# Altium schematic sheet SAMC21_Xplained_Pro_Connectors.SchDoc: Extension connectors
size A3; Organization: ATMEL Norway; Address1: Vestre Rosten 79; Address2: N-7075 TILLER; Address3: NORWAY; DocumentNumber: A09-2419; Revision: 5; SheetNumber: 3; SheetTotal: 9; PageSetup: Record=PageOptions|CenterHorizontal=True|CenterVertical=True|PrintScale=1.01|XCorrection=1.00|YCorrection=1.00|PrintKind=1|BorderSize=5000000|LeftOffset=0|BottomOffset=0|Orientation=2|PaperLength=1000|PaperWidth=1000|Scale=100|PaperSource=7|PrintQuality=-4|MediaType=1|DitherType=10|PaperKind=A3 (297 x 420 mm)|PrintScaleMode=1
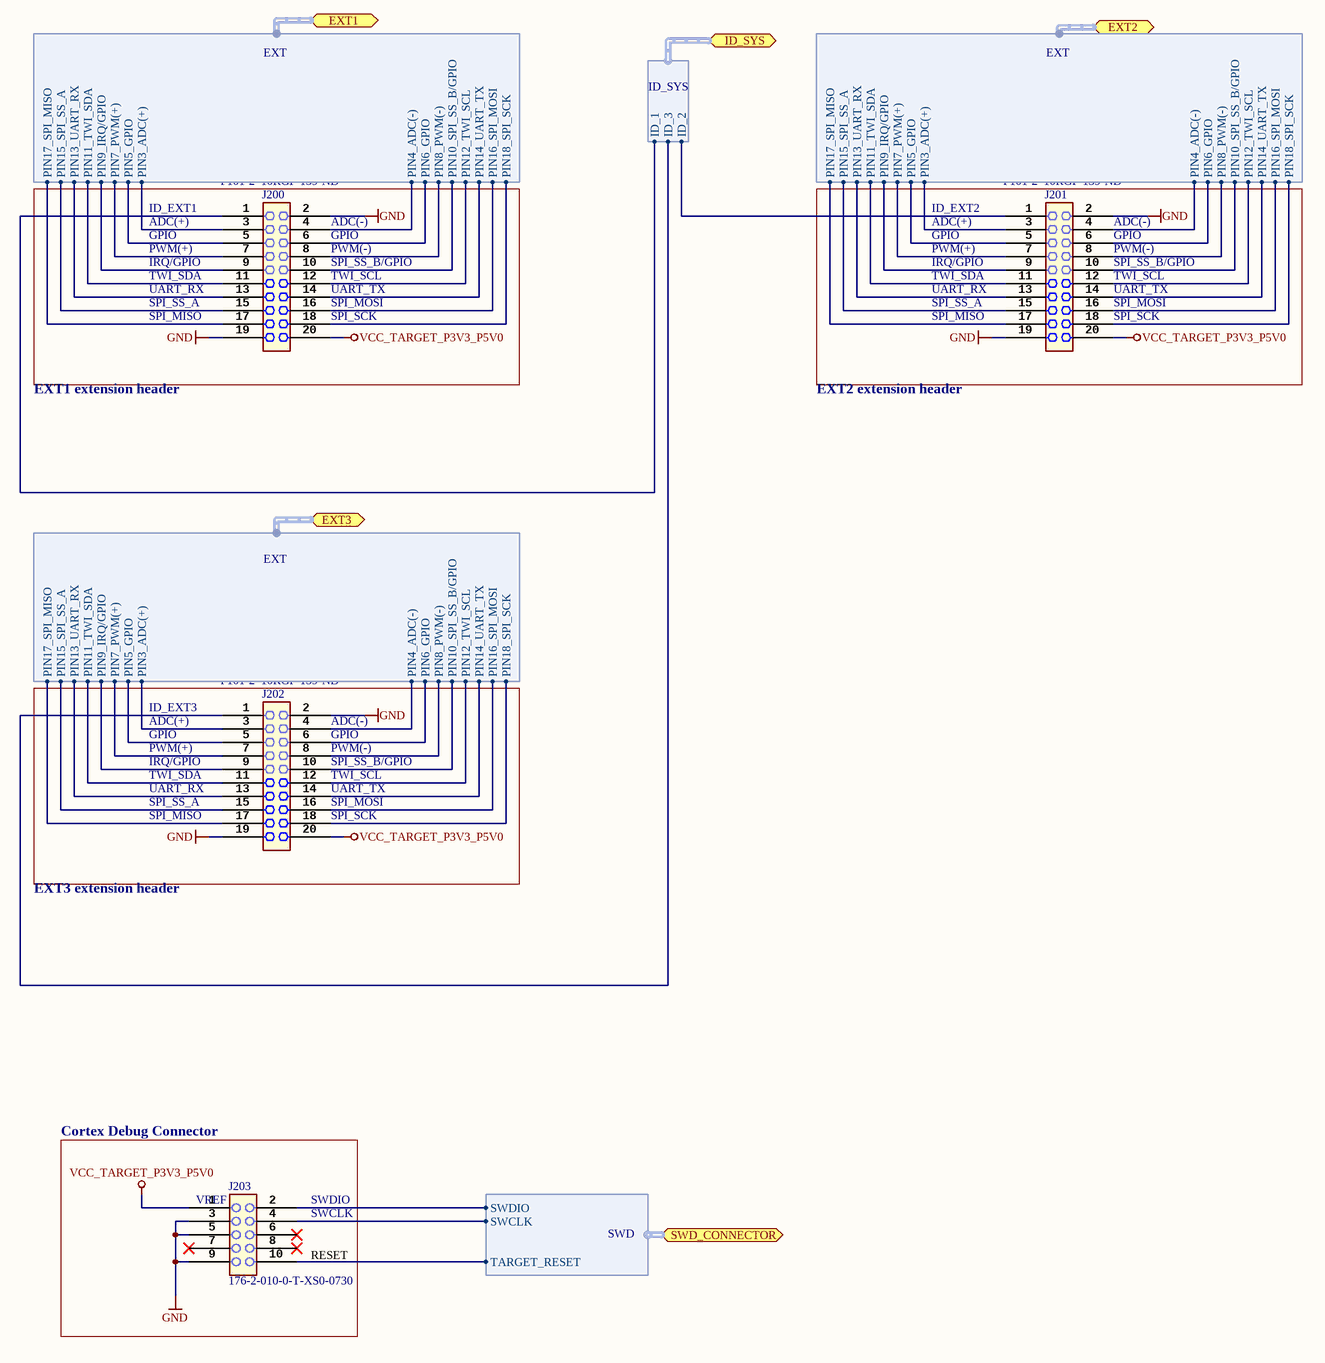
[diagram p0: SAMC21_Xplained_Pro_Connectors.SchDoc]

## Parts
J200  value P101-2*10RGF-139-ND  [AP8-00622]
J201  value P101-2*10RGF-139-ND  [AP8-00622]
J202  value P101-2*10RGF-139-ND  [AP8-00622]
J203  MPN: 176-2-010-0-T-XS0-0730  [AP8-00257]

## Blocks framed on the sheet
Cortex Debug Connector: J203

## Ports
EXT1 (harness EXT), EXT2 (harness EXT), EXT3 (harness EXT), ID_SYS (harness ID_SYS), SWD_CONNECTOR (harness SWD)

## Harnesses
ID_SYS: ID_1, ID_2, ID_3
EXT: PIN3_ADC(+), PIN4_ADC(-), PIN5_GPIO, PIN6_GPIO, PIN7_PWM(+), PIN8_PWM(-), PIN9_IRQ/GPIO, PIN10_SPI_SS_B/GPIO, PIN11_TWI_SDA, PIN12_TWI_SCL, PIN13_UART_RX, PIN14_UART_TX, PIN15_SPI_SS_A, PIN16_SPI_MOSI, PIN17_SPI_MISO, PIN18_SPI_SCK
SWD: SWCLK, SWDIO, TARGET_RESET

## Nets
GND: J200.2 J200.19 J201.2 J201.19 J202.2 J202.19 J203.3 J203.5 J203.9
VCC_TARGET_P3V3_P5V0: J200.20 J201.20 J202.20 J203.1
NetJ200_1: J200.1 ; port ID_SYS.ID_1
NetJ200_3: J200.3 ; port EXT1.PIN3_ADC(+)
NetJ200_4: J200.4 ; port EXT1.PIN4_ADC(-)
NetJ200_5: J200.5 ; port EXT1.PIN5_GPIO
NetJ200_6: J200.6 ; port EXT1.PIN6_GPIO
NetJ200_7: J200.7 ; port EXT1.PIN7_PWM(+)
NetJ200_8: J200.8 ; port EXT1.PIN8_PWM(-)
NetJ200_9: J200.9 ; port EXT1.PIN9_IRQ/GPIO
NetJ200_10: J200.10 ; port EXT1.PIN10_SPI_SS_B/GPIO
NetJ200_11: J200.11 ; port EXT1.PIN11_TWI_SDA
NetJ200_12: J200.12 ; port EXT1.PIN12_TWI_SCL
NetJ200_13: J200.13 ; port EXT1.PIN13_UART_RX
NetJ200_14: J200.14 ; port EXT1.PIN14_UART_TX
NetJ200_15: J200.15 ; port EXT1.PIN15_SPI_SS_A
NetJ200_16: J200.16 ; port EXT1.PIN16_SPI_MOSI
NetJ200_17: J200.17 ; port EXT1.PIN17_SPI_MISO
NetJ200_18: J200.18 ; port EXT1.PIN18_SPI_SCK
NetJ201_1: J201.1 ; port ID_SYS.ID_2
NetJ201_3: J201.3 ; port EXT2.PIN3_ADC(+)
NetJ201_4: J201.4 ; port EXT2.PIN4_ADC(-)
NetJ201_5: J201.5 ; port EXT2.PIN5_GPIO
NetJ201_6: J201.6 ; port EXT2.PIN6_GPIO
NetJ201_7: J201.7 ; port EXT2.PIN7_PWM(+)
NetJ201_8: J201.8 ; port EXT2.PIN8_PWM(-)
NetJ201_9: J201.9 ; port EXT2.PIN9_IRQ/GPIO
NetJ201_10: J201.10 ; port EXT2.PIN10_SPI_SS_B/GPIO
NetJ201_11: J201.11 ; port EXT2.PIN11_TWI_SDA
NetJ201_12: J201.12 ; port EXT2.PIN12_TWI_SCL
NetJ201_13: J201.13 ; port EXT2.PIN13_UART_RX
NetJ201_14: J201.14 ; port EXT2.PIN14_UART_TX
NetJ201_15: J201.15 ; port EXT2.PIN15_SPI_SS_A
NetJ201_16: J201.16 ; port EXT2.PIN16_SPI_MOSI
NetJ201_17: J201.17 ; port EXT2.PIN17_SPI_MISO
NetJ201_18: J201.18 ; port EXT2.PIN18_SPI_SCK
NetJ202_1: J202.1 ; port ID_SYS.ID_3
NetJ202_3: J202.3 ; port EXT3.PIN3_ADC(+)
NetJ202_4: J202.4 ; port EXT3.PIN4_ADC(-)
NetJ202_5: J202.5 ; port EXT3.PIN5_GPIO
NetJ202_6: J202.6 ; port EXT3.PIN6_GPIO
NetJ202_7: J202.7 ; port EXT3.PIN7_PWM(+)
NetJ202_8: J202.8 ; port EXT3.PIN8_PWM(-)
NetJ202_9: J202.9 ; port EXT3.PIN9_IRQ/GPIO
NetJ202_10: J202.10 ; port EXT3.PIN10_SPI_SS_B/GPIO
NetJ202_11: J202.11 ; port EXT3.PIN11_TWI_SDA
NetJ202_12: J202.12 ; port EXT3.PIN12_TWI_SCL
NetJ202_13: J202.13 ; port EXT3.PIN13_UART_RX
NetJ202_14: J202.14 ; port EXT3.PIN14_UART_TX
NetJ202_15: J202.15 ; port EXT3.PIN15_SPI_SS_A
NetJ202_16: J202.16 ; port EXT3.PIN16_SPI_MOSI
NetJ202_17: J202.17 ; port EXT3.PIN17_SPI_MISO
NetJ202_18: J202.18 ; port EXT3.PIN18_SPI_SCK
NetJ203_2: J203.2 ; port SWD_CONNECTOR.SWDIO
NetJ203_4: J203.4 ; port SWD_CONNECTOR.SWCLK
NetJ203_10: J203.10 ; port SWD_CONNECTOR.TARGET_RESET

Not connected (* = marked no-connect by the designer): J203 6* 7* 8*

## Notes on the sheet
- ID_EXT1
- ID_EXT2
- ADC(+)
- GPIO
- PWM(+)
- IRQ/GPIO
- TWI_SDA
- UART_RX
- (near J200) ADC(-)
- (near J200) GPIO
- (near J200) PWM(-)
- (near J200) SPI_SS_B/GPIO
- (near J200) TWI_SCL
- (near J200) UART_TX
- (near J201) ADC(-)
- (near J201) GPIO
- (near J201) PWM(-)
- (near J201) SPI_SS_B/GPIO
- (near J201) TWI_SCL
- (near J201) UART_TX
- SPI_SS_A
- SPI_MISO
- (near J200) SPI_MOSI
- (near J200) SPI_SCK
- (near J201) SPI_MOSI
- (near J201) SPI_SCK
- EXT1 extension header
- EXT2 extension header
- ID_EXT3
- (near J202) ADC(-)
- (near J202) GPIO
- (near J202) PWM(-)
- (near J202) SPI_SS_B/GPIO
- (near J202) TWI_SCL
- (near J202) UART_TX
- (near J202) SPI_MOSI
- (near J202) SPI_SCK
- EXT3 extension header
- (near J203) VREF
- SWDIO
- SWCLK
- RESET
- Date:
- PAGE:
- of
- TITLE:
- Document number:
- Revision:

## Library data of the parts
J200-J202 = A08-1513: Pin header, 2x10, Right Angle, 2.54mm, THM, Pin In Paste; PartGroup: Mechanical devices,Connectors,Pin headers; Manufacturer: Pro-data International Corp; AN: A08-1513; MPN: P101-2*10RGF-139-ND
J203 = A08-0385: 2x5 pin header, 1.27mm pitch, THM; PartGroup: Mechanical devices,Connectors,Pin headers; Manufacturer: Garry; Value: PIN HEADER 2x5; AN: A08-0385; Height: 7,30000019073486